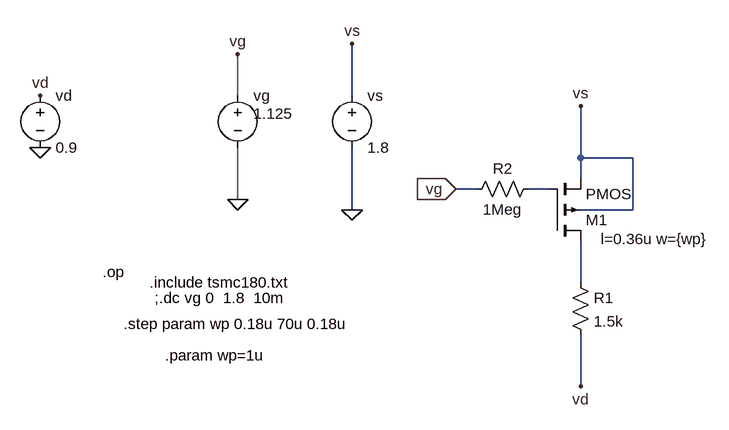
[diagram p0: schematic PMOS_CHART_SETUP.asc]
PMOS_CHART_SETUP.asc, the LTspice schematic file:
Version 4
SHEET 1 968 680
WIRE 192 112 192 48
WIRE 368 112 368 32
WIRE 720 208 720 128
WIRE 800 208 720 208
WIRE 720 240 720 208
WIRE 560 256 528 256
WIRE 672 256 640 256
WIRE 192 272 192 192
WIRE 368 288 368 192
WIRE 800 288 800 208
WIRE 800 288 720 288
WIRE 720 400 720 336
WIRE 720 560 720 480
FLAG 192 272 0
FLAG 368 288 0
FLAG 192 48 vg
FLAG 368 32 vs
FLAG 528 256 vg
IOPIN 528 256 In
FLAG 720 128 vs
FLAG -112 192 0
FLAG -112 112 vd
FLAG 720 560 vd
SYMBOL voltage 192 96 R0
WINDOW 3 24 44 Left 2
WINDOW 123 0 0 Left 0
WINDOW 39 0 0 Left 0
SYMATTR Value 1.125
SYMATTR InstName vg
SYMBOL voltage 368 96 R0
WINDOW 123 0 0 Left 0
WINDOW 39 0 0 Left 0
SYMATTR InstName vs
SYMATTR Value 1.8
SYMBOL res 656 240 R90
WINDOW 0 0 56 VBottom 2
WINDOW 3 32 56 VTop 2
SYMATTR InstName R2
SYMATTR Value 1Meg
SYMBOL pmos4 672 336 M180
WINDOW 123 79 3 Left 2
SYMATTR Value2 l=0.36u w={wp}
SYMATTR InstName M1
SYMBOL res 704 384 R0
SYMATTR InstName R1
SYMATTR Value 1.5k
SYMBOL voltage -112 96 R0
WINDOW 123 0 0 Left 0
WINDOW 39 0 0 Left 0
SYMATTR InstName vd
SYMATTR Value 0.9
TEXT 56 400 Left 2 !.include tsmc180.txt
TEXT 64 424 Left 2 !;.dc vg 0  1.8  10m
TEXT 16 464 Left 2 !.step param wp 0.18u 70u 0.18u
TEXT 80 512 Left 2 !.param wp=1u
TEXT -16 384 Left 2 !.op

The netlist it stands for:
* PMOS_CHART_SETUP.asc
vg vg 0 1.125
vs vs 0 1.8
R2 N001 vg 1Meg
M1 N002 N001 vs vs PMOS l=0.36u w={wp}
R1 N002 vd 1.5k
vd vd 0 0.9
.model NMOS NMOS
.model PMOS PMOS
.lib standard.mos
.include tsmc180.txt
;.dc vg 0  1.8  10m
.step param wp 0.18u 70u 0.18u
.param wp=1u
.op
.backanno
.end